# EasyEDA schematic M5 Stick DCC Interface_2020-05-23_20-41-17.json
TITLE: DCC Interface; REV: 1.0; Date: 2020-03-20; Sheet: 1/1; Drawn By: Hans R. Tanner; Company: IoTT - Internet of Toy Trains
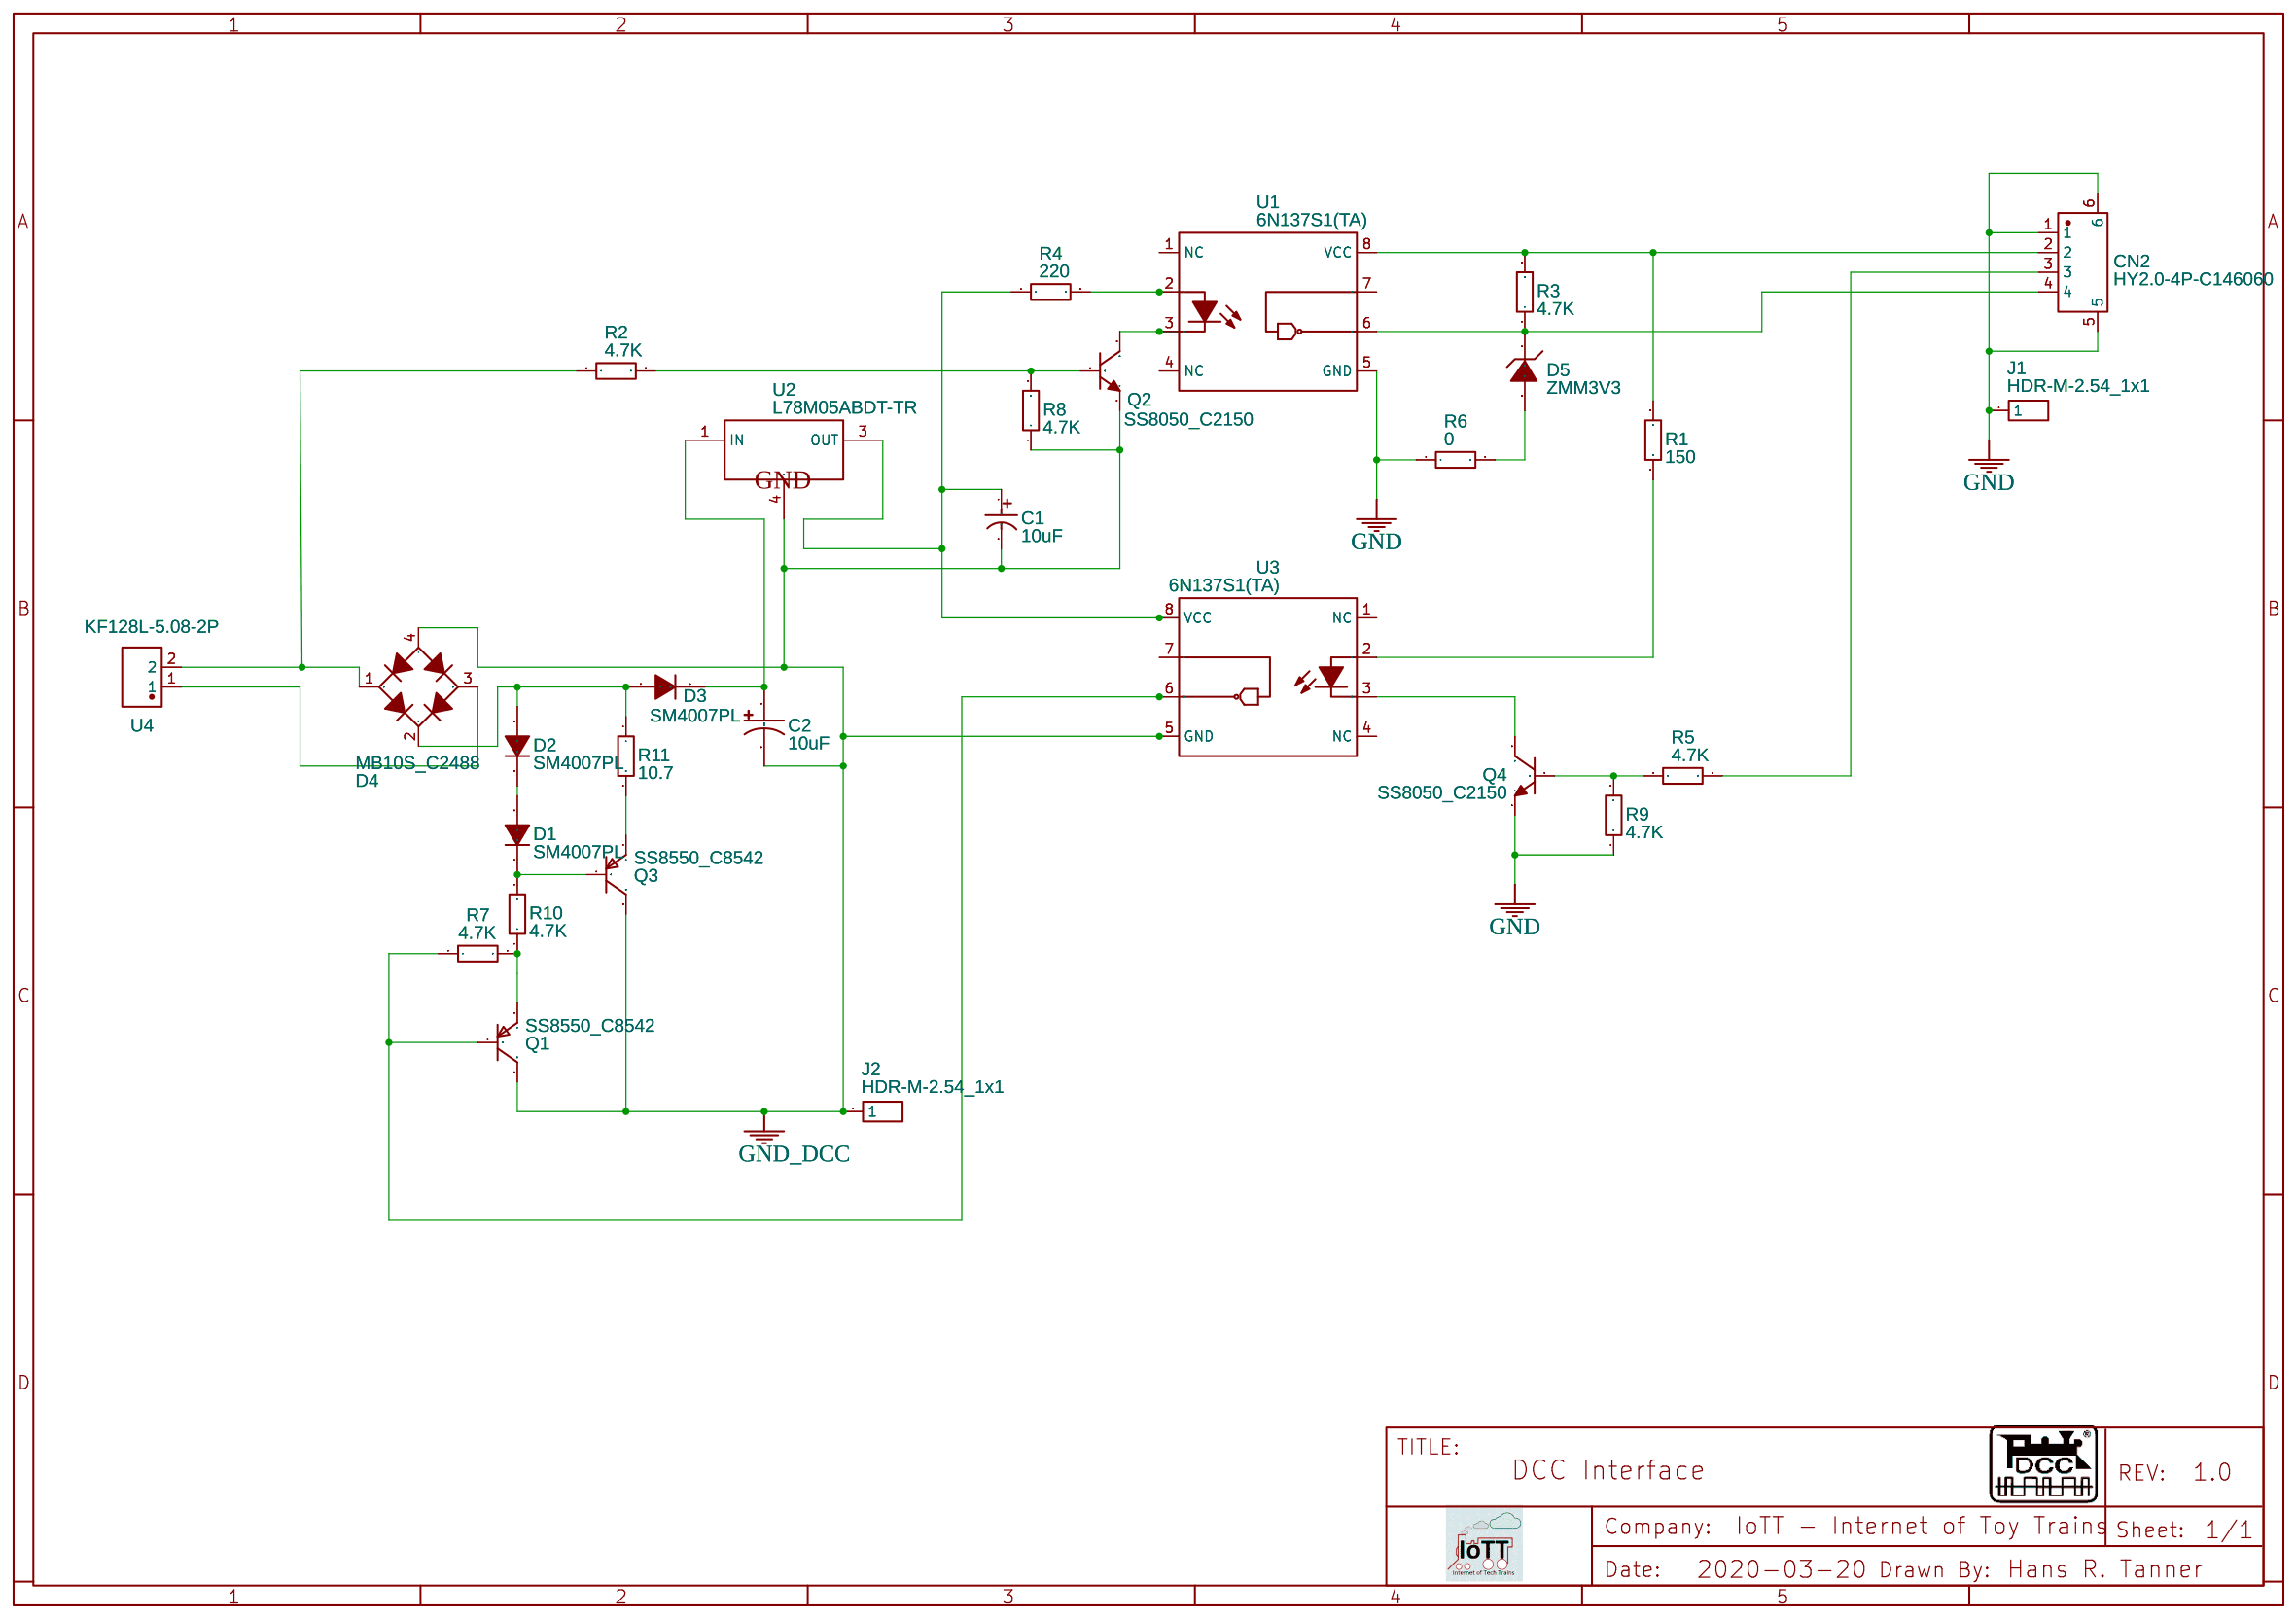
[diagram p0: schematic sheet]

## Parts
C1  10uF  [CAP-SMD_BD4.0-L4.3-W4.3-FD]
C2  10uF  [CAP-SMD_BD5.0-L5.3-W5.3-FD]
CN2  HY2.0-4P-C146060  [CONN-SMD_HY2.0-4P]
D1  SM4007PL  [SOD-123F_L2.8-W1.8-LS3.7-RD]
D2  SM4007PL  [SOD-123F_L2.8-W1.8-LS3.7-RD]
D3  SM4007PL  [SOD-123F_L2.8-W1.8-LS3.7-RD]
D4  MB10S_C2488  [DIO-BG-SMD_4P-L4.9-W4.0-P2.54-LS7.0-BL]
D5  ZMM3V3  [LL-34_L3.5-W1.5-RD]
J1  HDR-M-2.54_1x1  [HDR-M-2.54_1X1]
J2  HDR-M-2.54_1x1  [HDR-M-2.54_1X1]
Q1  SS8550_C8542  [SOT-23-3_L2.9-W1.3-P1.90-LS2.4-BR]
Q2  SS8050_C2150  [SOT-23-3_L2.9-W1.3-P1.90-LS2.4-BR]
Q3  SS8550_C8542  [SOT-23-3_L2.9-W1.3-P1.90-LS2.4-BR]
Q4  SS8050_C2150  [SOT-23-3_L2.9-W1.3-P1.90-LS2.4-BR]
R1  150  [R0603]
R2  4.7K  [R0603]
R3  4.7K  [R0603]
R4  220  [R0603]
R5  4.7K  [R0603]
R6  0  [R0402]
R7  4.7K  [R0603]
R8  4.7K  [R0603]
R9  4.7K  [R0603]
R10  4.7K  [R0603]
R11  10.7  [R0603]
U1  6N137S1(TA)  [SMD-8_L9.8-W6.6-P2.54-LS10.3-BL]
U2  L78M05ABDT-TR  [TO-252-2_L6.5-W6.1-P4.58-LS10.0-BR]
U3  6N137S1(TA)  [SMD-8_L9.8-W6.6-P2.54-LS10.3-BL]
U4  KF128L-5.08-2P  [CONN-TH_P5.08_KF128L-5.08-2P]

## Library data of the parts
C1 = VE-100M1ETR-0405: Supplier: LCSC; Manufacturer: LELON; Contributor: LCSC; Supplier Part: C134721; LCSC Assembly: Yes; SMT Type: Extend
C2 = VE-100M1H0505-TRO: Supplier: LCSC; Supplier Part: C249452; Manufacturer: Lelon; Contributor: LCSC; LCSC Assembly: Yes; SMT Type: Extend
CN2 = HY2.0-4P-C146060: Supplier: LCSC; Supplier Part: C146060; Manufacturer: Boom Precision Elec; Contributor: LCSC
D1-D3 = SM4007PL: Supplier: LCSC; Manufacturer: MDD; image: //image.lceda.cn/szlcsc/C64898.jpg; Supplier Part: C64898; LCSC Assembly: Yes; SMT Type: Basic
D4 = MB10S_C2488: Supplier: LCSC; Manufacturer: MDD; Manufacturer Part: MB10S; LCSC Assembly: Yes; image: //image.lceda.cn/szlcsc/C2488.jpg; Supplier Part: C2488; SMT Type: Basic
D5 = ZMM3V3: Supplier: LCSC; LCSC Assembly: Yes; Manufacturer: SEMTECH; image: //image.lceda.cn/szlcsc/C8056.jpg; Supplier Part: C8056; SMT Type: Basic
J1 J2 = HDR-M-2.54_1x1: Supplier Part: C81276; Supplier: LCSC; Contributor: LCEDA_Lib
Q1 Q3 = SS8550_C8542: Supplier: LCSC; Manufacturer: CJ; Manufacturer Part: SS8550; LCSC Assembly: Yes; image: //image.lceda.cn/szlcsc/C8542.jpg; Supplier Part: C8542; SMT Type: Basic
Q2 Q4 = SS8050_C2150: Supplier: LCSC; Manufacturer: CJ; Manufacturer Part: SS8050; LCSC Assembly: Yes; image: //image.lceda.cn/szlcsc/C2150.jpg; Supplier Part: C2150; SMT Type: Basic
R1 = 0603WAF1500T5E: Supplier: LCSC; Manufacturer: UniOhm; LCSC Assembly: Yes; Supplier Part: C22808; SMT Type: Basic
R2 R5 R7 R10 = 0603WAF4701T5E: Supplier: LCSC; Manufacturer: UniOhm; LCSC Assembly: Yes; Supplier Part: C23162; SMT Type: Basic
R3 R8 R9 = 0603WAF1001T5E: Supplier: LCSC; Manufacturer: UniOhm; Manufacturer Part: 0603WAF4701T5E; LCSC Assembly: Yes; Supplier Part: C23162; SMT Type: Basic
R4 = 0603WAF1500T5E: Supplier: LCSC; Manufacturer: UniOhm; Manufacturer Part: 0603WAF2200T5E; LCSC Assembly: Yes; Supplier Part: C22962; SMT Type: Basic
R6 = 0402WGF0000TCE: Supplier: LCSC; Manufacturer: UniOhm; LCSC Assembly: Yes; Supplier Part: C17168; SMT Type: Basic
R11 = 0603WAF107JT5E: Supplier: LCSC; Manufacturer: UniOhm; Supplier Part: C22774; LCSC Assembly: Yes; SMT Type: Extend
U1 U3 = 6N137S1(TA): Supplier: LCSC; Supplier Part: C110020; Manufacturer: Everlight Elec; Contributor: LCSC; LCSC Assembly: Yes; SMT Type: Basic
U2 = L78M05ABDT-TR: Supplier: LCSC; Manufacturer: STMicroelectronics; LCSC Assembly: Yes; image: //image.lceda.cn/szlcsc/C58069.jpg; Supplier Part: C58069; SMT Type: Basic
U4 = KF128L-5.08-2P: Supplier: LCSC; Supplier Part: C474940; Manufacturer: Cixi Kefa Elec; Contributor: LCSC

## Nets
GND: CN2.1 CN2.5 CN2.6 J1.1 Q4.2(E) R6.1 R9.1 U1.5(GND)
GND_DCC: C1.2 C2.2 D4.4(-) J2.1 Q1.3(C) Q2.2(E) Q3.3(C) R8.1 U2.4(GND) U3.5(GND)
Net-(C1-1): C1.1 R4.1 U2.3(OUT) U3.8(VCC)
Net-(C2-1): C2.1 D3.1(C) U2.1(IN)
Net-(CN2-2): CN2.2 R1.2 R3.2 U1.8(VCC)
Net-(CN2-3): CN2.3 R5.2
Net-(CN2-4): CN2.4 D5.1(C) R3.1 U1.6(VOUT)
Net-(D1-1): D1.1(C) Q3.1(B) R10.2
Net-(D1-2): D1.2(A) D2.1(C)
Net-(D2-2): D2.2(A) D3.2(A) D4.2(+) R11.1
Net-(D4-1): D4.1(C1) R2.1 U4.2
Net-(D4-3): D4.3(C2) U4.1
Net-(D5-2): D5.2(A) R6.2
Net-(Q1-1): Q1.1(B) R7.1 U3.6(VOUT)
Net-(Q1-2): Q1.2(E) R7.2 R10.1
Net-(Q2-1): Q2.1(B) R2.2 R8.2
Net-(Q2-3): Q2.3(C) U1.3(CAT)
Net-(Q3-2): Q3.2(E) R11.2
Net-(Q4-1): Q4.1(B) R5.1 R9.2
Net-(Q4-3): Q4.3(C) U3.3(CAT)
Net-(R1-1): R1.1 U3.2(AN)
Net-(R4-2): R4.2 U1.2(AN)

Not connected (* = marked no-connect by the designer): U1 1(NC) 4(NC) 7(VE); U3 1(NC) 4(NC) 7(VE)
